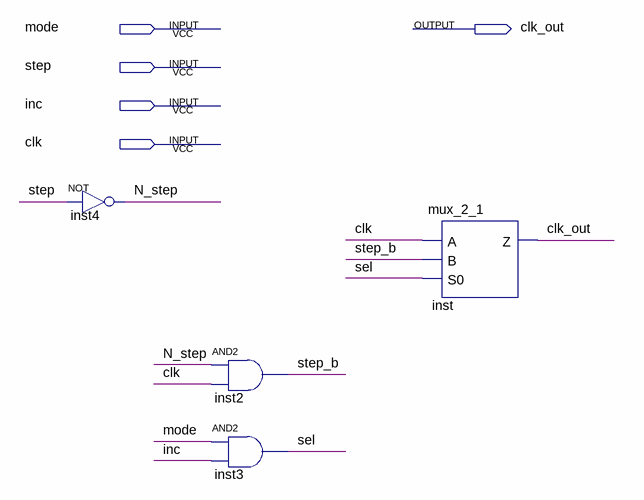
[diagram p0: schematic sheet]
// Quartus schematic run_step.bdf as structural Verilog: 4 symbols, 5 pins
module run_step (
  input  mode,
  input  step,
  input  inc,
  input  clk,
  output clk_out
);

  wire N_step, sel, step_b;

  not inst4 (N_step, step);
  and inst2 (step_b, N_step, clk);
  and inst3 (sel, mode, inc);
  mux_2_1 inst (.A(clk), .B(step_b), .S0(sel), .Z(clk_out));
endmodule
